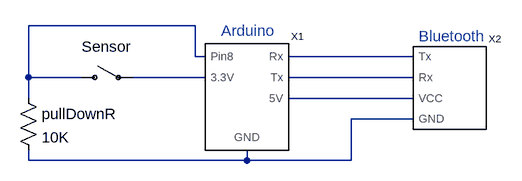
[diagram p0: schematic speedometerCircuit.asc]
speedometerCircuit.asc, the LTspice schematic file:
Version 4
SHEET 1 880 680
WIRE -32 208 -288 208
WIRE -32 256 -32 208
WIRE -16 256 -32 256
WIRE 304 256 112 256
WIRE -288 288 -288 208
WIRE -208 288 -288 288
WIRE -16 288 -128 288
WIRE 304 288 112 288
WIRE -288 320 -288 288
WIRE 304 320 112 320
WIRE 304 352 208 352
WIRE -288 416 -288 400
WIRE 48 416 48 400
WIRE 48 416 -288 416
WIRE 208 416 208 352
WIRE 208 416 48 416
SYMBOL arduino 64 304 R0
SYMATTR InstName X1
SYMBOL csw -208 288 R270
WINDOW 0 32 40 VTop 2
WINDOW 3 -32 40 VBottom 2
SYMATTR InstName Sensor
SYMATTR Value ""
SYMBOL res -304 304 R0
SYMATTR InstName pullDownR
SYMATTR Value 10K
SYMBOL bluetooth 304 368 R0
SYMATTR InstName X2
TEXT 8 216 Left 2 ;Arduino
TEXT 312 224 Left 2 ;Bluetooth

The netlist it stands for:
* speedometerCircuit.asc
XX1 N004 N002 N005 N006 N001 N003 arduino  ; pins Tx Rx 5V GND Pin8 3.3V
W§Sensor N001 N003
R§pullDownR N001 N006 10K
XX2 N002 N004 N006 N005 bluetooth  ; pins Tx Rx GND VCC
* Arduino
* Bluetooth
.backanno
.end